# Altium schematic sheet CATS-Vega-Baro.SchDoc: CATS Vega
size A4; DocumentNumber: Overview; Revision: V1.0; SheetNumber: 7; SheetTotal: 16; Author: Luca Jost; Subtitle: Barometer
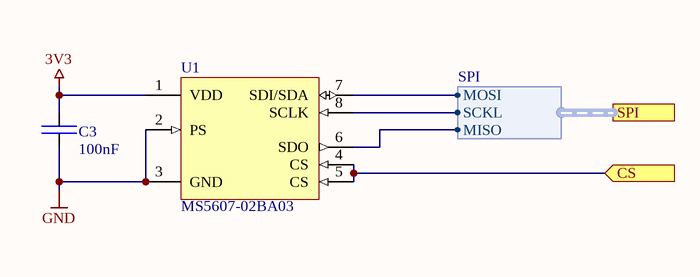
[diagram p0: CATS-Vega-Baro.SchDoc]

## Parts
C3  100nF  [SMD Keramikkondensator 0603]
U1  MS5607-02BA03  [SMD IC BARO MS5607]

## Ports
CS (in), SPI (harness SPI)

## Harnesses
SPI: SCKL, MOSI, MISO

## Nets
3V3: C3.2 U1.1(VDD)
GND: C3.1 U1.2(PS) U1.3(GND)
CS: U1.4(CS) U1.5(CS) ; port CS
NetU1_6: U1.6(SDO) ; port SPI.MISO
NetU1_7: U1.7(SDI/SDA) ; port SPI.MOSI
NetU1_8: U1.8(SCLK) ; port SPI.SCKL

## Notes on the sheet
- Title
- Author:
- Subtitle
- Date:
- Rev:
- File:
- Sheet
- of

## Library data of the parts
C3 = E6 - 100nF: SMD Ceramic Capacitor E6; Unit Price: 0.0024; JLC: C1591
U1 = MS5607-02BA03: Barometric Pressure Sensor, with stainless / steel cap; ComponentLink1Description: Datasheet; ComponentLink1URL: https://www.te.com/commerce/DocumentDelivery/DDEController?Action=srchrtrv&DocNm=MS5607-02BA03&DocType=Data+Sheet&DocLang=English; Digikey: 223-1198-1-ND; Mouser: 824-MS560702BA03-50; Unit Price: 3.47